# Altium schematic sheet shematic diagram.SchDoc (part 2 of 3)
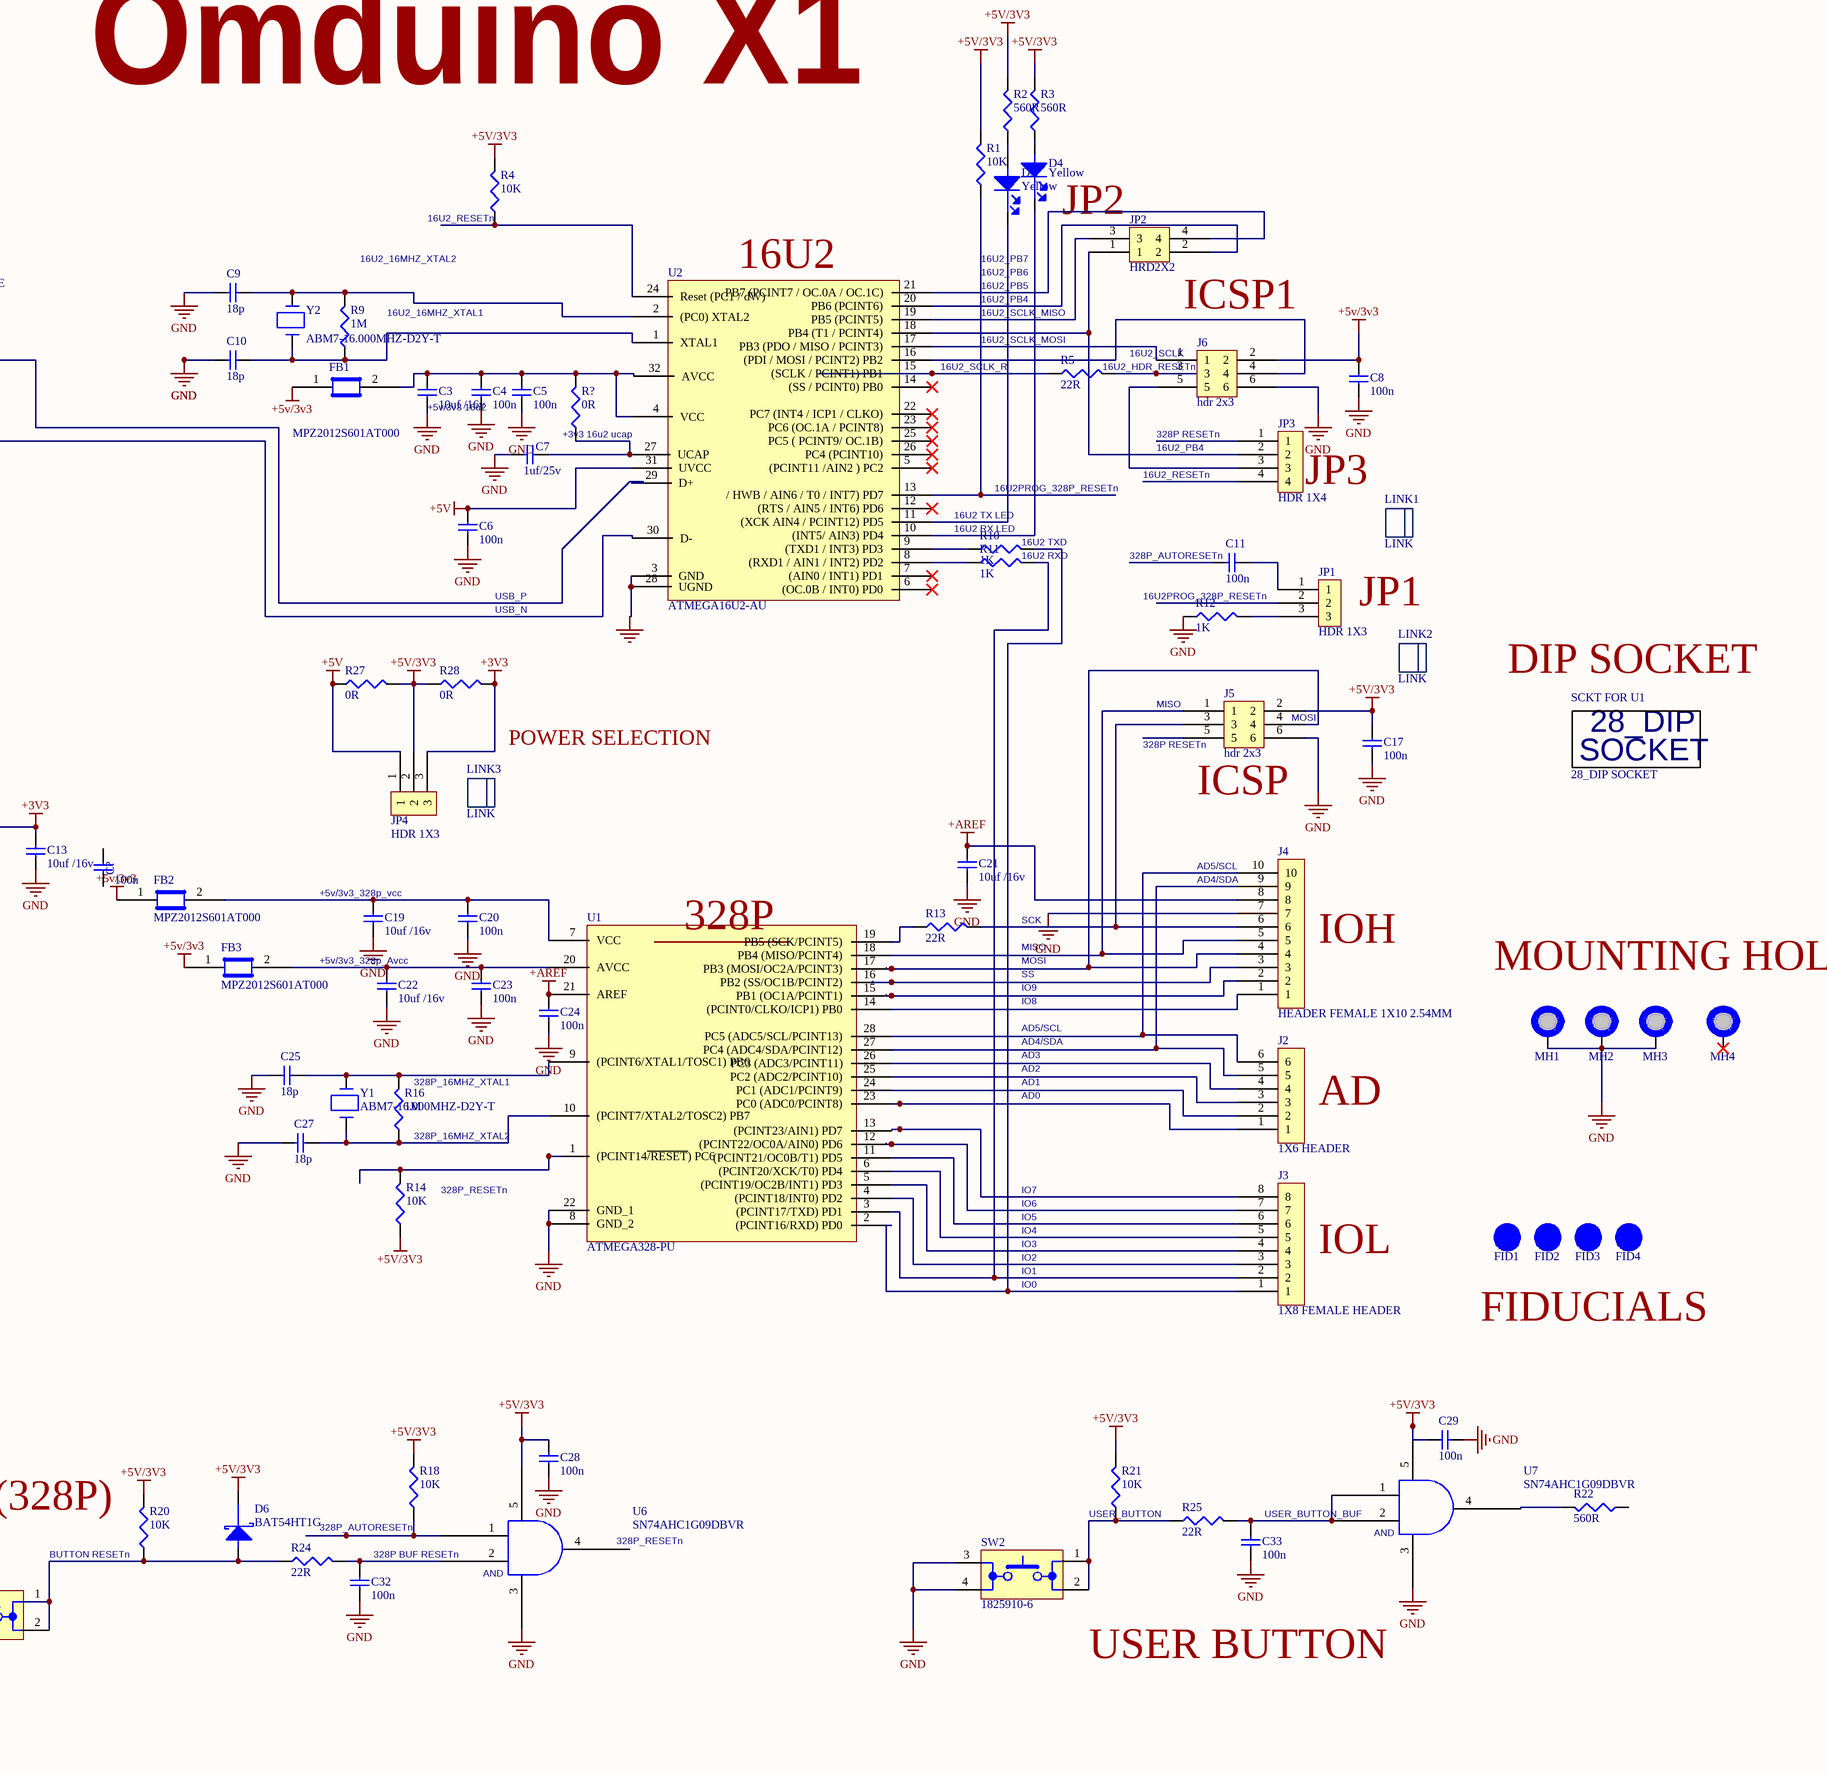
[diagram p4: shematic diagram.SchDoc, bottom right]
## Library data of the parts
C1 C2 = EEE-1AA101WR: Aluminum Electrolytic Capacitor, Polarized, Aluminum (wet), 10V, 20% +Tol, 20% -Tol, 100uF, Surface Mount, 2121; Manufacturer: Panasonic; Dielectric Material: Aluminium; Ripple Current: 50mA; Leakage Current: 10uA; Tan Delta: 0.3; Supplier: Digikey; Supplier Part Number: PCE3867CT-ND; Manufacturer Part Number: EEE-1AA101WR; RoHS: Yes; Category: Aluminum Electrolytic Capacitors; Stock: 77539; Pricing: 1=0.35, 10=0.228, 50=0.168, 100=0.1368, 500=0.108 (USD); Mounting Technology: Surface Mount; Pins: 2; Terminal Finish: Tin; Package Shape: Cylindrical; Case/Package: 2121; Min Operating Temperature: -40°C; Max Operating Temperature: 85°C; JESD-609 Code: e3,e6; Polarity: Polarized; Value: 100uF; Capacitor Type: Aluminium; Tolerance  (fill in as +-): 20%; Package Style: SMTMeter; Packaging: Tape and Reel; Tolerance (fill in as +-): 20%; Rated DC Voltage (URdc): 10V; Termination: Flat; Length: 6.5mm; Width: 5.3mm; Height: 5.4mm; RoHS Compliant: Yes; Reach SVHC Compliant: Yes; ComponentLink1URL: https://datasheet.ciiva.com:443/pdfs/VipMasterIC/IC/PANA/PANA-S-A0009615203/PANA-S-A0009615203-1.pdf?src-supplier=IHS+Markit; ComponentLink1Description: https://datasheet.ciiva.com:443/pdfs/VipMasterIC/IC/PANA/PANA-S-A0009615203/PANA-S-A0009615203-1.pdf?src-supplier=IHS+Markit; ComponentLink2URL: https://datasheet.ciiva.com/26945/getdatasheetpartid-169213-26945071.pdf?src-supplier=Verical; ComponentLink2Description: https://datasheet.ciiva.com/26945/getdatasheetpartid-169213-26945071.pdf?src-supplier=Verical; ComponentLink3URL: https://datasheet.ciiva.com/24027/aba0000ce2-40801-24027541.pdf?src-supplier=Mouser; ComponentLink3Description: https://datasheet.ciiva.com/24027/aba0000ce2-40801-24027541.pdf?src-supplier=Mouser; ComponentLink4URL: https://datasheet.ciiva.com/14598/70255710-14598233.pdf?src-supplier=Allied+Electronics; ComponentLink4Description: https://datasheet.ciiva.com/14598/70255710-14598233.pdf?src-supplier=Allied+Electronics; ComponentLink5URL: https://datasheet.ciiva.com/11673/aba0000ce2-11673882.pdf?src-supplier=Avnet; ComponentLink5Description: https://datasheet.ciiva.com/11673/aba0000ce2-11673882.pdf?src-supplier=Avnet; ComponentLink6URL: https://datasheet.ciiva.com/2983/aba0000ce2-2983906.pdf?src-supplier=Avnet; ComponentLink6Description: https://datasheet.ciiva.com/2983/aba0000ce2-2983906.pdf?src-supplier=Avnet; ComponentLink7URL: https://datasheet.ciiva.com/30075/11aba0000ce2-30075303.pdf?src-supplier=Onlinecomponents.com; ComponentLink7Description: https://datasheet.ciiva.com/30075/11aba0000ce2-30075303.pdf?src-supplier=Onlinecomponents.com; ComponentLink8URL: https://datasheet.ciiva.com/14605/70255710-14605689.pdf?src-supplier=Allied+Electronics; ComponentLink8Description: https://datasheet.ciiva.com/14605/70255710-14605689.pdf?src-supplier=Allied+Electronics; ComponentLink9URL: https://datasheet.ciiva.com/16427/aba0000ce2-16427544.pdf?src-supplier=Future+Electronics; ComponentLink9Description: https://datasheet.ciiva.com/16427/aba0000ce2-16427544.pdf?src-supplier=Future+Electronics
C3 C12 C13 C19 C21 C22 C34 = 10 uf /C2012X5R1C106M085AC: Ceramic Capacitor, Multilayer, Ceramic, 16V, 20% +Tol, 20% -Tol, X5R, 15% TC, 10uF, Surface Mount, 0805; Manufacturer: TDK; Multilayer: Yes; Supplier: Digikey; Supplier Part Number: 445-7645-1-ND; Manufacturer Part Number: C2012X5R1C106M085AC; RoHS: Yes; Category: Ceramic Capacitors; Stock: 610144; Pricing: 1=0.26, 10=0.169, 50=0.1066, 100=0.0853, 500=0.0616, 1000=0.05449 (USD); Mounting Technology: Surface Mount; Pins: 2; Dielectric Material: Ceramic; Package Shape: Rectangular; Case/Package: 0805; Terminal Finish: Nickel; Min Operating Temperature: -55°C; Max Operating Temperature: 85°C; JESD-609 Code: e3; Value: 10uF; Capacitor Type: Ceramic; Tolerance  (fill in as +-): 20%; Package Style: SMTMeter; Packaging: Tape and Reel; Tolerance (fill in as +-): 20%; Rated DC Voltage (URdc): 16V; Temperature Characteristics Code: X5R; Termination: Wraparound; Length: 2mm; Width: 1.25mm; Height: 0.85mm; Reach SVHC Compliant: Yes; RoHS Compliant: Yes; ComponentLink1URL: https://datasheet.ciiva.com:443/pdfs/VipMasterIC/IC/TDKC/TDKC-S-A0008796792/TDKC-S-A0008796792-1.pdf?src-supplier=IHS+Markit; ComponentLink1Description: https://datasheet.ciiva.com:443/pdfs/VipMasterIC/IC/TDKC/TDKC-S-A0008796792/TDKC-S-A0008796792-1.pdf?src-supplier=IHS+Markit; ComponentLink2URL: https://datasheet.ciiva.com/24218/c2012x5r1c106m085ac-265002-24218340.pdf?src-supplier=Mouser; ComponentLink2Description: https://datasheet.ciiva.com/24218/c2012x5r1c106m085ac-265002-24218340.pdf?src-supplier=Mouser; ComponentLink3URL: https://datasheet.ciiva.com/11788/0900766b80c1bb00-11788108.pdf?src-supplier=Rs; ComponentLink3Description: https://datasheet.ciiva.com/11788/0900766b80c1bb00-11788108.pdf?src-supplier=Rs; ComponentLink4URL: https://datasheet.ciiva.com/22725/1913358-22725557.pdf?src-supplier=Element14; ComponentLink4Description: https://datasheet.ciiva.com/22725/1913358-22725557.pdf?src-supplier=Element14; ComponentLink5URL: https://datasheet.ciiva.com/6290/tdkmlcccaprange-6290485.pdf?src-supplier=Digikey; ComponentLink5Description: https://datasheet.ciiva.com/6290/tdkmlcccaprange-6290485.pdf?src-supplier=Digikey; ComponentLink6URL: https://datasheet.ciiva.com/23803/1796654-23803021.pdf?src-supplier=Newark; ComponentLink6Description: https://datasheet.ciiva.com/23803/1796654-23803021.pdf?src-supplier=Newark; ComponentLink7URL: https://datasheet.ciiva.com/6290/tdkmlcccaprange-6290487.pdf?src-supplier=Digikey; ComponentLink7Description: https://datasheet.ciiva.com/6290/tdkmlcccaprange-6290487.pdf?src-supplier=Digikey; ComponentLink8URL: https://datasheet.ciiva.com/16449/e412-c-16449591.pdf?src-supplier=Future+Electronics; ComponentLink8Description: https://datasheet.ciiva.com/16449/e412-c-16449591.pdf?src-supplier=Future+Electronics
C4-C6 C8 C11 C14-C17 C20 C23 C24 C26 C28-C33 C? = C2012X7R1H104K085AA: Ceramic Capacitor, Multilayer, Ceramic, 50V, 10% +Tol, 10% -Tol, X7R, 15% TC, 0.1uF, Surface Mount, 0805; Manufacturer: TDK; Value: 100nF; Multilayer: Yes; Supplier: Digikey; Supplier Part Number: 445-7534-1-ND; Manufacturer Part Number: C2012X7R1H104K085AA; RoHS: Yes; Category: Ceramic Capacitors; Stock: 1483565; Pricing: 1=0.14, 10=0.092, 50=0.0552, 100=0.0434, 500=0.03204, 1000=0.02653 (USD); Mounting Technology: Surface Mount; Pins: 2; Dielectric Material: Ceramic; Package Shape: Rectangular; Case/Package: 0805; Terminal Finish: Nickel; Min Operating Temperature: -55°C; Max Operating Temperature: 125°C; JESD-609 Code: e3; Capacitor Type: Ceramic; Tolerance  (fill in as +-): 10%; Package Style: SMTMeter; Packaging: Tape and Reel; Tolerance (fill in as +-): 10%; Rated DC Voltage (URdc): 50V; Temperature Characteristics Code: X7R; Termination: Wraparound; Length: 2mm; Width: 1.25mm; Height: 0.85mm; Reach SVHC Compliant: Yes; RoHS Compliant: Yes; ComponentLink1URL: https://datasheet.ciiva.com:443/pdfs/VipMasterIC/IC/TDKC/TDKC-S-A0008796792/TDKC-S-A0008796792-1.pdf?src-supplier=IHS+Markit; ComponentLink1Description: https://datasheet.ciiva.com:443/pdfs/VipMasterIC/IC/TDKC/TDKC-S-A0008796792/TDKC-S-A0008796792-1.pdf?src-supplier=IHS+Markit; ComponentLink2URL: https://datasheet.ciiva.com/11788/0900766b80c1bb00-11788128.pdf?src-supplier=Rs; ComponentLink2Description: https://datasheet.ciiva.com/11788/0900766b80c1bb00-11788128.pdf?src-supplier=Rs; ComponentLink3URL: https://datasheet.ciiva.com/23803/1796654-23803035.pdf?src-supplier=Newark; ComponentLink3Description: https://datasheet.ciiva.com/23803/1796654-23803035.pdf?src-supplier=Newark; ComponentLink4URL: https://datasheet.ciiva.com/28602/1571323-28602204.pdf?src-supplier=Element14; ComponentLink4Description: https://datasheet.ciiva.com/28602/1571323-28602204.pdf?src-supplier=Element14; ComponentLink5URL: https://datasheet.ciiva.com/6250/tdkmlcccaprange-6250824.pdf?src-supplier=Digikey; ComponentLink5Description: https://datasheet.ciiva.com/6250/tdkmlcccaprange-6250824.pdf?src-supplier=Digikey; ComponentLink6URL: https://datasheet.ciiva.com/24191/e412-c-24191447.pdf?src-supplier=Future+Electronics; ComponentLink6Description: https://datasheet.ciiva.com/24191/e412-c-24191447.pdf?src-supplier=Future+Electronics; ComponentLink7URL: https://datasheet.ciiva.com/6250/tdkmlcccaprange-6250821.pdf?src-supplier=Digikey; ComponentLink7Description: https://datasheet.ciiva.com/6250/tdkmlcccaprange-6250821.pdf?src-supplier=Digikey
C7 = C2012X5R1E105K125AA: Ceramic Capacitor, Multilayer, Ceramic, 25V, 10% +Tol, 10% -Tol, X5R, 15% TC, 1uF, Surface Mount, 0805; Manufacturer: TDK; Multilayer: Yes; Supplier: Digikey; Supplier Part Number: 445-1419-1-ND; Manufacturer Part Number: C2012X5R1E105K125AA; RoHS: Yes; Category: Ceramic Capacitors; Stock: 73732; Pricing: 1=0.22, 10=0.141, 50=0.089, 100=0.0712, 500=0.05142, 1000=0.04548 (USD); Mounting Technology: Surface Mount; Pins: 2; Dielectric Material: Ceramic; Terminal Finish: Nickel; Package Shape: Rectangular; Case/Package: 0805; Min Operating Temperature: -55°C; Max Operating Temperature: 85°C; JESD-609 Code: e3; Capacitor Type: Ceramic; Value: 1uF; Tolerance  (fill in as +-): 10%; Package Style: SMTMeter; Packaging: Tape and Reel; Tolerance (fill in as +-): 10%; Rated DC Voltage (URdc): 25V; Temperature Characteristics Code: X5R; Termination: Wraparound; Length: 2mm; Width: 1.25mm; Height: 1.25mm; Reach SVHC Compliant: Yes; RoHS Compliant: Yes; ComponentLink1URL: https://datasheet.ciiva.com:443/pdfs/VipMasterIC/IC/TDKC/TDKC-S-A0008796792/TDKC-S-A0008796792-1.pdf?src-supplier=IHS+Markit; ComponentLink1Description: https://datasheet.ciiva.com:443/pdfs/VipMasterIC/IC/TDKC/TDKC-S-A0008796792/TDKC-S-A0008796792-1.pdf?src-supplier=IHS+Markit; ComponentLink2URL: https://datasheet.ciiva.com/11787/0900766b80c1bb00-11787608.pdf?src-supplier=Rs; ComponentLink2Description: https://datasheet.ciiva.com/11787/0900766b80c1bb00-11787608.pdf?src-supplier=Rs; ComponentLink3URL: https://datasheet.ciiva.com/28602/1744655-28602171.pdf?src-supplier=Element14; ComponentLink3Description: https://datasheet.ciiva.com/28602/1744655-28602171.pdf?src-supplier=Element14; ComponentLink4URL: https://datasheet.ciiva.com/16449/e412-c-16449595.pdf?src-supplier=Future+Electronics; ComponentLink4Description: https://datasheet.ciiva.com/16449/e412-c-16449595.pdf?src-supplier=Future+Electronics; ComponentLink5URL: https://datasheet.ciiva.com/15192/getdatasheetpartid-726707-15192140.pdf?src-supplier=Verical; ComponentLink5Description: https://datasheet.ciiva.com/15192/getdatasheetpartid-726707-15192140.pdf?src-supplier=Verical
C9 C10 C25 C27 = C0805C180J5GACTU: Ceramic Capacitor, Multilayer, Ceramic, 50V, 5% +Tol, 5% -Tol, C0G, -/+30ppm/Cel TC, 0.000018uF, Surface Mount, 0805; Manufacturer: KEMET; Value: 18pF; Multilayer: Yes; Supplier: Digikey; Supplier Part Number: 399-C0805C180J5GAC7800CT-ND; Manufacturer Part Number: C0805C180J5GACTU; RoHS: Yes; Category: Ceramic Capacitors; Stock: 74721; Pricing: 1=0.11, 10=0.075, 50=0.045, 100=0.0355, 500=0.02618, 1000=0.02168 (USD); Mounting Technology: Surface Mount; Pins: 2; Dielectric Material: Ceramic; Package Shape: Rectangular; Case/Package: 0805; Terminal Finish: Nickel; Min Operating Temperature: -55°C; Max Operating Temperature: 125°C; JESD-609 Code: e3; Termination: Wraparound; Capacitor Type: Ceramic; Tolerance  (fill in as +-): 5%; Packaging: Tape and Reel; Tolerance (fill in as +-): 5%; Rated DC Voltage (URdc): 50V; Temperature Characteristics Code: C0G; RoHS Compliant: Yes; Reach SVHC Compliant: Yes; ComponentLink1URL: https://datasheet.ciiva.com:443/pdfs/VipMasterIC/IC/KEME/KEME-S-A0000339979/KEME-S-A0000339979-1.pdf?src-supplier=IHS+Markit; ComponentLink1Description: https://datasheet.ciiva.com:443/pdfs/VipMasterIC/IC/KEME/KEME-S-A0000339979/KEME-S-A0000339979-1.pdf?src-supplier=IHS+Markit; ComponentLink2URL: https://datasheet.ciiva.com/22746/1769375-22746770.pdf?src-supplier=Element14; ComponentLink2Description: https://datasheet.ciiva.com/22746/1769375-22746770.pdf?src-supplier=Element14; ComponentLink3URL: https://datasheet.ciiva.com/26923/getdatasheetpartid-759702-26923980.pdf?src-supplier=Verical; ComponentLink3Description: https://datasheet.ciiva.com/26923/getdatasheetpartid-759702-26923980.pdf?src-supplier=Verical; ComponentLink4URL: https://datasheet.ciiva.com/26847/getdatasheetpartid-385668-26847862.pdf?src-supplier=Verical; ComponentLink4Description: https://datasheet.ciiva.com/26847/getdatasheetpartid-385668-26847862.pdf?src-supplier=Verical
D1 D2 = LOL29K-J2L1-24-Z: Single Color LED, Orange, Colorless Diffused, 1.3mm; Manufacturer: Osram Opto; Supplier: Digikey; Supplier Part Number: 475-LOL29K-J2L1-24-0-2-R18-ZCT-ND; Manufacturer Part Number: LOL29K-J2L1-24-Z; RoHS: Yes; Category: LEDs; Pricing: 1=0.41 (USD); ComponentLink1URL: https://datasheet.ciiva.com:443/pdfs/VipMasterIC/IC/OSOS/OSOS-S-A0008796331/OSOS-S-A0008796331-1.pdf?src-supplier=IHS+Markit; ComponentLink1Description: https://datasheet.ciiva.com:443/pdfs/VipMasterIC/IC/OSOS/OSOS-S-A0008796331/OSOS-S-A0008796331-1.pdf?src-supplier=IHS+Markit; ComponentLink2URL: https://datasheet.ciiva.com/26920/getdatasheetpartid-707592-26920833.pdf?src-supplier=Verical; ComponentLink2Description: https://datasheet.ciiva.com/26920/getdatasheetpartid-707592-26920833.pdf?src-supplier=Verical; ComponentLink3URL: https://datasheet.ciiva.com/2112/00077105-0-2112938.pdf?src-supplier=Digikey; ComponentLink3Description: https://datasheet.ciiva.com/2112/00077105-0-2112938.pdf?src-supplier=Digikey; ComponentLink4URL: https://datasheet.ciiva.com/2112/00077105-0-2112937.pdf?src-supplier=Digikey; ComponentLink4Description: https://datasheet.ciiva.com/2112/00077105-0-2112937.pdf?src-supplier=Digikey; ComponentLink5URL: https://datasheet.ciiva.com/2112/00077105-0-2112939.pdf?src-supplier=Digikey; ComponentLink5Description: https://datasheet.ciiva.com/2112/00077105-0-2112939.pdf?src-supplier=Digikey
D3 D4 D? = LYL29K-H1K2-26-Z: LED Uni-Color Yellow 591nm 2-Pin SMT T/R; Manufacturer: Osram Opto; Supplier: Digikey; Supplier Part Number: 475-LYL29K-H1K2-26-ZCT-ND; Manufacturer Part Number: LYL29K-H1K2-26-Z; RoHS: Yes; Category: LEDs; Stock: 93893; Pricing: 1=0.37, 10=0.293, 100=0.1315, 500=0.11878, 1000=0.09757, 2000=0.08484 (USD); ComponentLink1URL: https://datasheet.ciiva.com/26920/getdatasheetpartid-774632-26920797.pdf?src-supplier=Verical; ComponentLink1Description: https://datasheet.ciiva.com/26920/getdatasheetpartid-774632-26920797.pdf?src-supplier=Verical; ComponentLink2URL: https://datasheet.ciiva.com/2112/00077106-0-2112835.pdf?src-supplier=Digikey; ComponentLink2Description: https://datasheet.ciiva.com/2112/00077106-0-2112835.pdf?src-supplier=Digikey; ComponentLink3URL: https://datasheet.ciiva.com/2112/00077106-0-2112837.pdf?src-supplier=Digikey; ComponentLink3Description: https://datasheet.ciiva.com/2112/00077106-0-2112837.pdf?src-supplier=Digikey; ComponentLink4URL: https://datasheet.ciiva.com/2112/00077106-0-2112836.pdf?src-supplier=Digikey; ComponentLink4Description: https://datasheet.ciiva.com/2112/00077106-0-2112836.pdf?src-supplier=Digikey; ComponentLink5URL: https://datasheet.ciiva.com/4688/lyl29k-smartled0603-471955-4688317.pdf?src-supplier=Mouser; ComponentLink5Description: https://datasheet.ciiva.com/4688/lyl29k-smartled0603-471955-4688317.pdf?src-supplier=Mouser
D5 D6 = BAT54HT1G: Rectifier Diode, 1 Phase, 1 Element, 0.2A, 30V V(RRM), Silicon; Manufacturer: ON Semiconductor / Fairchild; Package Body Material: Plastic; Forward Voltage: 240mV; Non-rep Pk Forward Current-Max: 600mA; Number of Elements: 1; Max Output current: 200mA; Max Power Dissipation: 200mW; Reverse Recovery Time-Max: 0.005us; Qualification Status: Not Qualified; Supplier: Digikey; Supplier Part Number: BAT54HT1GOSCT-ND; Manufacturer Part Number: BAT54HT1G; RoHS: Yes; Category: Schottky Diodes; Stock: 171294; Pricing: 1=0.2, 10=0.138, 100=0.0675, 500=0.05634, 1000=0.03915 (USD); Pins: 2; Diode Element Material: SILICON; Package Shape: Rectangular; Terminal Finish: Tin; Min Operating Temperature: -55°C; Max Operating Temperature: 150°C; Diode Type: RECTIFIER; JESD-30 Code: R-PDSO-G2; Package Style: SMALL OUTLINEMeter; Rep Pk Reverse Voltage-Max: 30V; Surface Mount: Yes; Terminal Form: Gull Wing; Terminal Position: DUAL; JESD-609 Code: e3; Moisture Sensitivity Level: 1; RoHS Compliant: Yes; Reach SVHC Compliant: Yes; ComponentLink1URL: https://datasheet.ciiva.com:443/pdfs/VipMasterIC/IC/FAIR/FAIRS45107/FAIRS45107-1.pdf?src-supplier=IHS+Markit; ComponentLink1Description: https://datasheet.ciiva.com:443/pdfs/VipMasterIC/IC/FAIR/FAIRS45107/FAIRS45107-1.pdf?src-supplier=IHS+Markit; ComponentLink2URL: https://datasheet.ciiva.com/4714/bat54ht1-d-72881-4714706.pdf?src-supplier=Mouser; ComponentLink2Description: https://datasheet.ciiva.com/4714/bat54ht1-d-72881-4714706.pdf?src-supplier=Mouser; ComponentLink3URL: https://datasheet.ciiva.com/4452/bat54ht1g-104602-4452889.pdf?src-supplier=Mouser; ComponentLink3Description: https://datasheet.ciiva.com/4452/bat54ht1g-104602-4452889.pdf?src-supplier=Mouser; ComponentLink4URL: https://datasheet.ciiva.com/30479/0900766b811a63a9-30479442.pdf?src-supplier=Rs; ComponentLink4Description: https://datasheet.ciiva.com/30479/0900766b811a63a9-30479442.pdf?src-supplier=Rs; ComponentLink5URL: https://datasheet.ciiva.com/34301/806549-34301562.pdf?src-supplier=Jameco; ComponentLink5Description: https://datasheet.ciiva.com/34301/806549-34301562.pdf?src-supplier=Jameco; ComponentLink6URL: https://datasheet.ciiva.com/1240/1747983-1240762.pdf?src-supplier=Newark; ComponentLink6Description: https://datasheet.ciiva.com/1240/1747983-1240762.pdf?src-supplier=Newark; ComponentLink7URL: https://datasheet.ciiva.com/915/bat54ht1-d-915445.pdf?src-supplier=Digikey; ComponentLink7Description: https://datasheet.ciiva.com/915/bat54ht1-d-915445.pdf?src-supplier=Digikey; ComponentLink8URL: https://datasheet.ciiva.com/915/bat54ht1-d-915444.pdf?src-supplier=Digikey; ComponentLink8Description: https://datasheet.ciiva.com/915/bat54ht1-d-915444.pdf?src-supplier=Digikey; ComponentLink9URL: https://datasheet.ciiva.com/910/bat54ht1g-910499.pdf?src-supplier=Digikey; ComponentLink9Description: https://datasheet.ciiva.com/910/bat54ht1g-910499.pdf?src-supplier=Digikey; ComponentLink10URL: https://datasheet.ciiva.com/910/bat54ht1g-910498.pdf?src-supplier=Digikey; ComponentLink10Description: https://datasheet.ciiva.com/910/bat54ht1g-910498.pdf?src-supplier=Digikey; ComponentLink11URL: https://datasheet.ciiva.com/8294/bat54ht1-d-8294645.pdf?src-supplier=Avnet; ComponentLink11Description: https://datasheet.ciiva.com/8294/bat54ht1-d-8294645.pdf?src-supplier=Avnet; ComponentLink12URL: https://datasheet.ciiva.com/910/bat54ht1g-910497.pdf?src-supplier=Digikey; ComponentLink12Description: https://datasheet.ciiva.com/910/bat54ht1g-910497.pdf?src-supplier=Digikey; ComponentLink13URL: https://datasheet.ciiva.com/8303/bat54ht1g-8303645.pdf?src-supplier=Avnet; ComponentLink13Description: https://datasheet.ciiva.com/8303/bat54ht1g-8303645.pdf?src-supplier=Avnet; ComponentLink14URL: https://datasheet.ciiva.com/915/bat54ht1-d-915443.pdf?src-supplier=Digikey; ComponentLink14Description: https://datasheet.ciiva.com/915/bat54ht1-d-915443.pdf?src-supplier=Digikey; ComponentLink15URL: https://datasheet.ciiva.com/46429/1727620-46429206.pdf?src-supplier=Element14; ComponentLink15Description: https://datasheet.ciiva.com/46429/1727620-46429206.pdf?src-supplier=Element14; ComponentLink16URL: https://datasheet.ciiva.com/1180/bat54ht1-d-1180252.pdf?src-supplier=Element14; ComponentLink16Description: https://datasheet.ciiva.com/1180/bat54ht1-d-1180252.pdf?src-supplier=Element14; ComponentLink17URL: https://datasheet.ciiva.com/1180/bat54ht1-d-1180251.pdf?src-supplier=Element14; ComponentLink17Description: https://datasheet.ciiva.com/1180/bat54ht1-d-1180251.pdf?src-supplier=Element14; ComponentLink18URL: https://datasheet.ciiva.com/17020/bat54ht1g-17020445.pdf?src-supplier=Future+Electronics; ComponentLink18Description: https://datasheet.ciiva.com/17020/bat54ht1g-17020445.pdf?src-supplier=Future+Electronics; ComponentLink19URL: https://datasheet.ciiva.com/48686/001262925-da-01-en-diode-schottky-30v-bat54ht1g-sod-323-fsc-48686266.pdf?src-supplier=Conrad; ComponentLink19Description: https://datasheet.ciiva.com/48686/001262925-da-01-en-diode-schottky-30v-bat54ht1g-sod-323-fsc-48686266.pdf?src-supplier=Conrad
FB1-FB3 = MPZ2012S601AT000: Ferrite Chip, 1 Function(s), 2A; Manufacturer: TDK; DC Resistance-Max: 100mR; Clock Frequency: 100MHz; Channels: 1; Output Impedance: 600R; Supplier: Digikey; Supplier Part Number: 445-MPZ2012S601AT000CT-ND; Manufacturer Part Number: MPZ2012S601AT000; RoHS: Yes; Category: Ferrite Beads and Chips; Stock: 173654; Pricing: 1=0.12, 10=0.094, 25=0.0848, 50=0.0622, 100=0.0537, 250=0.0424, 500=0.03582, 1000=0.03016 (USD); Mounting Technology: Surface Mount; Material: Ferrite; Case Code: 0805; Terminal Finish: Copper; Min Operating Temperature: -55°C; Max Operating Temperature: 125°C; JESD-609 Code: e2; Construction: Chip Bead; Filter Type: FERRITE CHIP; Min Frequency: 100MHz; Packaging: Tape and Reel; Current Rating: 2A; Length: 2mm; Width: 1.25mm; Height: 0.85mm; Reach SVHC Compliant: Yes; RoHS Compliant: Yes; ComponentLink1URL: https://datasheet.ciiva.com:443/pdfs/VipMasterIC/IC/TDKC/TDKC-S-A0008032886/TDKC-S-A0008032886-1.pdf?src-supplier=IHS+Markit; ComponentLink1Description: https://datasheet.ciiva.com:443/pdfs/VipMasterIC/IC/TDKC/TDKC-S-A0008032886/TDKC-S-A0008032886-1.pdf?src-supplier=IHS+Markit; ComponentLink2URL: https://datasheet.ciiva.com/46634/beads-commercial-power-mpz-en-46634335.pdf?src-supplier=Digikey; ComponentLink2Description: https://datasheet.ciiva.com/46634/beads-commercial-power-mpz-en-46634335.pdf?src-supplier=Digikey; ComponentLink3URL: https://datasheet.ciiva.com/46634/beads-commercial-power-mpz-en-46634377.pdf?src-supplier=Digikey; ComponentLink3Description: https://datasheet.ciiva.com/46634/beads-commercial-power-mpz-en-46634377.pdf?src-supplier=Digikey; ComponentLink4URL: https://datasheet.ciiva.com/46634/beads-commercial-power-mpz-en-46634606.pdf?src-supplier=Digikey; ComponentLink4Description: https://datasheet.ciiva.com/46634/beads-commercial-power-mpz-en-46634606.pdf?src-supplier=Digikey
FID1-FID4 = FID_1MM: FIDUCIAL 40 MIL DIAMETER , 120 MIL MASK
J1 J3 = M20-7820842: Board Connector, 8 Contact(s), 1 Row(s), Female, Straight, 0.1 inch Pitch, Solder Terminal, Locking, Black Insulator, Socket; Manufacturer: Harwin; Option: General Purpose; Contact Pattern: RECTANGULAR; Contact Resistance: 20mR; Contact Style: SQ PIN-SKT; Dielectric Withstanding Voltage (AC): 1kV; Durability: 300Cycles; Filter Feature: No; Insulation Resistance: 1GR; Number Of Connectors: 1; Polarization Key: POLARIZED HOUSING; Rated Current (Signal): 3A; Number of Contacts: 8; Body Breadth: 0.098inch; Body Depth: 0.335inch; Body Length: 0.8inch; Reference Standard: UL; Reliability: COMMERCIAL; Supplier: Digikey; Supplier Part Number: 952-1823-ND; Manufacturer Part Number: M20-7820842; RoHS: Yes; Category: Headers and Wire Housings; Stock: 2451; Pricing: 1=1.44, 27=1.16556, 108=1.09102, 513=0.89263, 1026=0.79346, 5022=0.69427, 10017=0.65956 (USD); Mounting Technology: Board; Contact Finish - Mating: GOLD; Contact Finish - Termination: Tin (Sn) - with Nickel (Ni) barrier; Insulation Color: Black; Insulation Material: Polyamide; Min Operating Temperature: -40°C; Max Operating Temperature: 105°C; Connector Type: BOARD CONNECTOR; JESD-609 Code: e3; Body/Shell Style: SOCKET; Contact Gender: Female; Mixed Contacts: No; Mounting Style: STRAIGHT; Number Of PCB Rows: 1; Number of Rows Loaded: 1; PCB Contact Pattern: RECTANGULAR; Termination: Solder; Mating Contact Pitch: 0.1inch; Mounting Option 1: LOCKING; Terminal Length: 0.118inch; Terminal Pitch: 2.54mm; Flammability Rating: UL94 V-0; DIN Conformance: No; IEC Conformance: No; MIL Conformance: No; Reach SVHC Compliant: Yes; RoHS Compliant: Yes; ComponentLink1URL: https://datasheet.ciiva.com:443/pdfs/VipMasterIC/IC/HRWN/HRWN-S-A0004894635/HRWN-S-A0004894635-1.pdf?src-supplier=IHS+Markit; ComponentLink1Description: https://datasheet.ciiva.com:443/pdfs/VipMasterIC/IC/HRWN/HRWN-S-A0004894635/HRWN-S-A0004894635-1.pdf?src-supplier=IHS+Markit; ComponentLink2URL: https://datasheet.ciiva.com/9480/m20-782-9480074.pdf?src-supplier=Avnet; ComponentLink2Description: https://datasheet.ciiva.com/9480/m20-782-9480074.pdf?src-supplier=Avnet
J2 = M20-7820646: Board Connector, 6 Contact(s), 1 Row(s), Female, Straight, 0.1 inch Pitch, Solder Terminal, Locking, Black Insulator, Socket; Manufacturer: Harwin; Option: General Purpose; Contact Pattern: RECTANGULAR; Contact Resistance: 20mR; Contact Style: SQ PIN-SKT; Dielectric Withstanding Voltage (AC): 1kV; Durability: 300Cycles; Filter Feature: No; Insulation Resistance: 1GR; Number Of Connectors: 1; Polarization Key: POLARIZED HOUSING; Rated Current (Signal): 3A; Number of Contacts: 6; Body Breadth: 0.098inch; Body Depth: 0.335inch; Body Length: 0.6inch; Reference Standard: UL; Reliability: COMMERCIAL; Supplier: Digikey; Supplier Part Number: 952-1809-ND; Manufacturer Part Number: M20-7820646; RoHS: Yes; Category: Headers and Wire Housings; Stock: 878; Pricing: 1=1.24, 36=1.00861, 108=0.94435, 504=0.77266, 1008=0.6868, 5004=0.60095, 10008=0.5709 (USD); Mounting Technology: Board; Contact Finish - Mating: TIN; Contact Finish - Termination: Tin (Sn) - with Nickel (Ni) barrier; Insulation Color: Black; Insulation Material: Polyamide; Min Operating Temperature: -40°C; Max Operating Temperature: 105°C; Connector Type: BOARD CONNECTOR; JESD-609 Code: e3; Body/Shell Style: SOCKET; Contact Gender: Female; Mixed Contacts: No; Mounting Style: STRAIGHT; Number Of PCB Rows: 1; Number of Rows Loaded: 1; PCB Contact Pattern: RECTANGULAR; Termination: Solder; Mating Contact Pitch: 0.1inch; Mounting Option 1: LOCKING; Terminal Length: 0.118inch; Terminal Pitch: 2.54mm; Flammability Rating: UL94 V-0; DIN Conformance: No; IEC Conformance: No; MIL Conformance: No; Reach SVHC Compliant: Yes; RoHS Compliant: Yes; ComponentLink1URL: https://datasheet.ciiva.com:443/pdfs/VipMasterIC/IC/HRWN/HRWN-S-A0004894635/HRWN-S-A0004894635-1.pdf?src-supplier=IHS+Markit; ComponentLink1Description: https://datasheet.ciiva.com:443/pdfs/VipMasterIC/IC/HRWN/HRWN-S-A0004894635/HRWN-S-A0004894635-1.pdf?src-supplier=IHS+Markit; ComponentLink2URL: https://cdn.harwin.com/pdfs/Harwin_PC_Connectors_M20.pdf?src-supplier=Rs; ComponentLink2Description: https://cdn.harwin.com/pdfs/Harwin_PC_Connectors_M20.pdf?src-supplier=Rs; ComponentLink3URL: http://www.harwin.com/include/downloads/pdfs/2010PAGE120.PDF?src-supplier=Avnet; ComponentLink3Description: http://www.harwin.com/include/downloads/pdfs/2010PAGE120.PDF?src-supplier=Avnet; ComponentLink4URL: https://cdn.harwin.com/pdfs/M20-782.pdf?src-supplier=Digikey; ComponentLink4Description: https://cdn.harwin.com/pdfs/M20-782.pdf?src-supplier=Digikey; ComponentLink5URL: https://cdn.harwin.com/pdfs/Harwin_PC_Connectors_M20.pdf?src-supplier=Mouser; ComponentLink5Description: https://cdn.harwin.com/pdfs/Harwin_PC_Connectors_M20.pdf?src-supplier=Mouser; ComponentLink6URL: https://cdn.harwin.com/pdfs/Harwin_PC_Connectors_M20.pdf?src-supplier=TTI; ComponentLink6Description: https://cdn.harwin.com/pdfs/Harwin_PC_Connectors_M20.pdf?src-supplier=TTI
J4 = M20-7821046: Board Connector, 10 Contact(s), 1 Row(s), Female, Straight, 0.1 inch Pitch, Solder Terminal, Locking, Black Insulator, Socket; Manufacturer: Harwin; Option: General Purpose; Contact Pattern: RECTANGULAR; Contact Resistance: 20mR; Contact Style: SQ PIN-SKT; Dielectric Withstanding Voltage (AC): 1kV; Durability: 300Cycles; Filter Feature: No; Insertion Force-Max: 4.8928N; Insulation Resistance: 1GR; Number Of Connectors: 1; Polarization Key: POLARIZED HOUSING; Rated Current (Signal): 3A; Number of Contacts: 10; Body Breadth: 0.098inch; Body Depth: 0.335inch; Body Length: 1inch; Reference Standard: UL; Reliability: COMMERCIAL; Supplier: Digikey; Supplier Part Number: 952-1847-ND; Manufacturer Part Number: M20-7821046; RoHS: Yes; Category: Headers and Wire Housings; Stock: 2123; Pricing: 1=1.46, 22=1.27, 110=1.13473, 506=0.94561, 1012=0.81052, 5016=0.71867, 10010=0.70245 (USD); Mounting Technology: Board; Contact Finish - Mating: TIN; Contact Finish - Termination: Tin (Sn) - with Nickel (Ni) barrier; Insulation Color: Black; Insulation Material: Nylon; Min Operating Temperature: -40°C; Max Operating Temperature: 105°C; Connector Type: BOARD CONNECTOR; JESD-609 Code: e3; Body/Shell Style: SOCKET; Contact Gender: Female; Mixed Contacts: No; Mounting Style: STRAIGHT; Number Of PCB Rows: 1; Number of Rows Loaded: 1; PCB Contact Pattern: RECTANGULAR; Termination: Solder; Mating Contact Pitch: 0.1inch; Mounting Option 1: LOCKING; Terminal Length: 0.118inch; Terminal Pitch: 2.54mm; Flammability Rating: UL94 V-0; Reach SVHC Compliant: Yes; RoHS Compliant: Yes; DIN Conformance: No; IEC Conformance: No; MIL Conformance: No; ComponentLink1URL: https://datasheet.ciiva.com:443/pdfs/VipMasterIC/IC/HRWN/HRWN-S-A0004894635/HRWN-S-A0004894635-1.pdf?src-supplier=IHS+Markit; ComponentLink1Description: https://datasheet.ciiva.com:443/pdfs/VipMasterIC/IC/HRWN/HRWN-S-A0004894635/HRWN-S-A0004894635-1.pdf?src-supplier=IHS+Markit; ComponentLink2URL: https://datasheet.ciiva.com/11753/0900766b80dc1d2b-11753869.pdf?src-supplier=Rs; ComponentLink2Description: https://datasheet.ciiva.com/11753/0900766b80dc1d2b-11753869.pdf?src-supplier=Rs; ComponentLink3URL: https://datasheet.ciiva.com/26899/getdatasheetpartid-559226-26899379.pdf?src-supplier=Verical; ComponentLink3Description: https://datasheet.ciiva.com/26899/getdatasheetpartid-559226-26899379.pdf?src-supplier=Verical; ComponentLink4URL: https://datasheet.ciiva.com/6785/m20-782-6785605.pdf?src-supplier=Digikey; ComponentLink4Description: https://datasheet.ciiva.com/6785/m20-782-6785605.pdf?src-supplier=Digikey; ComponentLink5URL: https://datasheet.ciiva.com/10151/m20-782-10151366.pdf?src-supplier=Avnet; ComponentLink5Description: https://datasheet.ciiva.com/10151/m20-782-10151366.pdf?src-supplier=Avnet
J5 J6 = 67997-106HLF: Conn Unshrouded Header HDR 6 POS 2.54mm Solder ST Top Entry Thru-Hole BergStik® Bulk; Manufacturer: Amphenol ICC / FCI; Supplier: Digikey; Supplier Part Number: 609-3393-ND; Manufacturer Part Number: 67997-106HLF; RoHS: No; Category: Headers and Wire Housings; Stock: 1064; Pricing: 1=0.63, 10=0.547, 100=0.4511, 500=0.39228, 1000=0.32363, 5000=0.28441, 10000=0.26479 (USD); ComponentLink1URL: http://uk.rs-online.com/webdocs/1450/0900766b81450b8b.pdf?src-supplier=Rs; ComponentLink1Description: http://uk.rs-online.com/webdocs/1450/0900766b81450b8b.pdf?src-supplier=Rs; ComponentLink2URL: http://www.farnell.com/datasheets/1876884.pdf?src-supplier=Newark; ComponentLink2Description: http://www.farnell.com/datasheets/1876884.pdf?src-supplier=Newark; ComponentLink3URL: https://cdn.amphenol-icc.com/media/wysiwyg/files/drawing/67996.pdf?src-supplier=Onlinecomponents.com; ComponentLink3Description: https://cdn.amphenol-icc.com/media/wysiwyg/files/drawing/67996.pdf?src-supplier=Onlinecomponents.com; ComponentLink4URL: https://cdn.amphenol-icc.com/media/wysiwyg/files/drawing/67996.pdf?src-supplier=Allied+Electronics; ComponentLink4Description: https://cdn.amphenol-icc.com/media/wysiwyg/files/drawing/67996.pdf?src-supplier=Allied+Electronics; ComponentLink5URL: https://datasheet.octopart.com/67997-106HLF-Areva-datasheet-118652.pdf?src-supplier=Digikey; ComponentLink5Description: https://datasheet.octopart.com/67997-106HLF-Areva-datasheet-118652.pdf?src-supplier=Digikey; ComponentLink6URL: http://components.arrow.com/part/dataview/41913658S7633350N8314?src-supplier=Arrow+Electronics; ComponentLink6Description: http://components.arrow.com/part/dataview/41913658S7633350N8314?src-supplier=Arrow+Electronics; ComponentLink7URL: https://datasheet.octopart.com/67997-106HLF-Amphenol-Communications-Solutions-datasheet-36854132.pdf?src-supplier=Farnell; ComponentLink7Description: https://datasheet.octopart.com/67997-106HLF-Amphenol-Communications-Solutions-datasheet-36854132.pdf?src-supplier=Farnell; ComponentLink8URL: https://cdn.amphenol-icc.com/media/wysiwyg/files/drawing/67996.pdf?src-supplier=Avnet; ComponentLink8Description: https://cdn.amphenol-icc.com/media/wysiwyg/files/drawing/67996.pdf?src-supplier=Avnet; ComponentLink9URL: https://cdn.amphenol-icc.com/media/wysiwyg/files/drawing/67996.pdf?src-supplier=Mouser; ComponentLink9Description: https://cdn.amphenol-icc.com/media/wysiwyg/files/drawing/67996.pdf?src-supplier=Mouser; ComponentLink10URL: https://cdn.amphenol-icc.com/media/wysiwyg/files/drawing/67996.pdf?src-supplier=Heilind+Electronics; ComponentLink10Description: https://cdn.amphenol-icc.com/media/wysiwyg/files/drawing/67996.pdf?src-supplier=Heilind+Electronics; ComponentLink11URL: https://cdn.amphenol-icc.com/media/wysiwyg/files/drawing/67996.pdf?src-supplier=TTI; ComponentLink11Description: https://cdn.amphenol-icc.com/media/wysiwyg/files/drawing/67996.pdf?src-supplier=TTI
J7 = 10118193-0001LF: USB Connector, 5 Contact(s), Female, Right Angle, Surface Mount Terminal, Locking, Receptacle; Manufacturer: Amphenol Communications Solutions; Supplier: Digikey; Supplier Part Number: 609-4616-1-ND; Manufacturer Part Number: 10118193-0001LF; RoHS: No; Category: USB Connectors; Stock: 201468; Pricing: 1=0.46, 10=0.404, 25=0.3696, 50=0.3478, 100=0.3334, 250=0.30436, 500=0.28988 (USD); ComponentLink1URL: https://datasheet.octopart.com/10118193-0001LF-Amphenol-Communications-Solutions-datasheet-96019471.pdf?src-supplier=Element14; ComponentLink1Description: https://datasheet.octopart.com/10118193-0001LF-Amphenol-Communications-Solutions-datasheet-96019471.pdf?src-supplier=Element14; ComponentLink2URL: https://datasheet.octopart.com/10118193-0001LF-Amphenol-Communications-Solutions-datasheet-55953155.pdf?src-supplier=TME; ComponentLink2Description: https://datasheet.octopart.com/10118193-0001LF-Amphenol-Communications-Solutions-datasheet-55953155.pdf?src-supplier=TME; ComponentLink3URL: https://datasheet.octopart.com/10118193-0001LF-Amphenol-Communications-Solutions-datasheet-11792339.pdf?src-supplier=Electro+Sonic; ComponentLink3Description: https://datasheet.octopart.com/10118193-0001LF-Amphenol-Communications-Solutions-datasheet-11792339.pdf?src-supplier=Electro+Sonic
J8 J9 = PAD_WITH_HOLE_4MMX1.5MM: PAD WITH A HOLE
JP1 JP4 = 68000-103HLF: Conn Unshrouded Header HDR 3 POS 2.54mm Solder ST Top Entry Thru-Hole BergStik® Automotive Bulk; Manufacturer: Amphenol ICC / FCI; Supplier: Digikey; Supplier Part Number: 609-3461-ND; Manufacturer Part Number: 68000-103HLF; RoHS: No; Category: Headers and Wire Housings; Stock: 34479; Pricing: 1=0.37, 10=0.317, 100=0.2462, 500=0.21104, 1000=0.17587, 5000=0.15074, 10000=0.14069 (USD); ComponentLink1URL: https://datasheet.ciiva.com/46392/1914865-46392021.pdf?src-supplier=Element14; ComponentLink1Description: https://datasheet.ciiva.com/46392/1914865-46392021.pdf?src-supplier=Element14
JP2 = 68602-204HLF: Manufacturer: AMPHENOL ICC (FCI); Supplier: Digikey; Supplier Part Number: 609-3369-ND; Manufacturer Part Number: 68602-204HLF; RoHS: No
JP3 = 68001-204HLF: Conn Unshrouded Header HDR 4 POS 2.54mm Solder ST Thru-Hole Bag; Manufacturer: Amphenol ICC / FCI; Supplier: Digikey; Supplier Part Number: 609-3402-ND; Manufacturer Part Number: 68001-204HLF; RoHS: No; Category: Headers and Wire Housings; Stock: 14181; Pricing: 1=0.48, 10=0.407, 100=0.3162, 500=0.27106, 1000=0.22589, 5000=0.19362, 10000=0.18071 (USD); ComponentLink1URL: http://uk.rs-online.com/webdocs/1450/0900766b81450c68.pdf?src-supplier=Rs; ComponentLink1Description: http://uk.rs-online.com/webdocs/1450/0900766b81450c68.pdf?src-supplier=Rs; ComponentLink2URL: https://datasheet.octopart.com/68001-204HLF-Amphenol-Communications-Solutions-datasheet-41232361.pdf?src-supplier=Element14; ComponentLink2Description: https://datasheet.octopart.com/68001-204HLF-Amphenol-Communications-Solutions-datasheet-41232361.pdf?src-supplier=Element14; ComponentLink3URL: https://cdn.amphenol-icc.com/media/wysiwyg/files/drawing/68000.pdf?src-supplier=Allied+Electronics; ComponentLink3Description: https://cdn.amphenol-icc.com/media/wysiwyg/files/drawing/68000.pdf?src-supplier=Allied+Electronics; ComponentLink4URL: https://cdn.amphenol-icc.com/media/wysiwyg/files/drawing/68000.pdf?src-supplier=Digikey; ComponentLink4Description: https://cdn.amphenol-icc.com/media/wysiwyg/files/drawing/68000.pdf?src-supplier=Digikey; ComponentLink5URL: http://components.arrow.com/part/dataview/42735081S8853857N8314?src-supplier=Arrow+Electronics; ComponentLink5Description: http://components.arrow.com/part/dataview/42735081S8853857N8314?src-supplier=Arrow+Electronics; ComponentLink6URL: https://cdn.amphenol-icc.com/media/wysiwyg/files/drawing/68000.pdf?src-supplier=Avnet; ComponentLink6Description: https://cdn.amphenol-icc.com/media/wysiwyg/files/drawing/68000.pdf?src-supplier=Avnet; ComponentLink7URL: https://cdn.amphenol-icc.com/media/wysiwyg/files/drawing/68000.pdf?src-supplier=Mouser; ComponentLink7Description: https://cdn.amphenol-icc.com/media/wysiwyg/files/drawing/68000.pdf?src-supplier=Mouser; ComponentLink8URL: https://datasheet.octopart.com/68001-204HLF-Amphenol-Communications-Solutions-datasheet-100449246.pdf?src-supplier=Future+Electronics; ComponentLink8Description: https://datasheet.octopart.com/68001-204HLF-Amphenol-Communications-Solutions-datasheet-100449246.pdf?src-supplier=Future+Electronics; ComponentLink9URL: https://datasheet.octopart.com/68001-204HLF-Amphenol-Communications-Solutions-datasheet-154727322.pdf?src-supplier=Master+Electronics; ComponentLink9Description: https://datasheet.octopart.com/68001-204HLF-Amphenol-Communications-Solutions-datasheet-154727322.pdf?src-supplier=Master+Electronics; ComponentLink10URL: https://cdn.amphenol-icc.com/media/wysiwyg/files/drawing/68000.pdf?src-supplier=Heilind+Electronics; ComponentLink10Description: https://cdn.amphenol-icc.com/media/wysiwyg/files/drawing/68000.pdf?src-supplier=Heilind+Electronics; ComponentLink11URL: https://cdn.amphenol-icc.com/media/wysiwyg/files/drawing/68000.pdf?src-supplier=TTI; ComponentLink11Description: https://cdn.amphenol-icc.com/media/wysiwyg/files/drawing/68000.pdf?src-supplier=TTI
L1 = CIGT252008LM2R2MNE: General Purpose Inductor, 2.2uH, 20%, 1 Element, Metal Composite-Core, SMD; Manufacturer: Samsung; Core Material: Metal,Composite; DC Resistance (DCR): 97mR; Inductor Application: POWER INDUCTOR; Channels: 1; Max Current Rating: 2A; Shape/Size Description: RECTANGULAR PACKAGE; Shielding: Unshielded; Test Frequency: 1MHz; Supplier: Digikey; Supplier Part Number: 1276-6925-1-ND; Manufacturer Part Number: CIGT252008LM2R2MNE; RoHS: Yes; Category: Fixed Inductors; Stock: 204708; Pricing: 1=0.16, 10=0.129, 25=0.1192, 50=0.1094, 100=0.0964, 250=0.09344, 500=0.0835, 1000=0.07 (USD); Pins: 2; Min Operating Temperature: -40°C; Max Operating Temperature: 125°C; Tolerance: 20%; Inductance-Nom (L): 2.2uH; Inductor Type: GENERAL PURPOSE INDUCTOR; Surface Mount: Yes; Terminal Placement: Dual Ended; Termination: Wraparound; Reach SVHC Compliant: Yes; RoHS Compliant: Yes; ComponentLink1URL: https://datasheet.ciiva.com:443/pdfs/VipMasterIC/IC/SEMS/SEMS-S-A0002828022/SEMS-S-A0002828022-1.pdf?src-supplier=IHS+Markit; ComponentLink1Description: https://datasheet.ciiva.com:443/pdfs/VipMasterIC/IC/SEMS/SEMS-S-A0002828022/SEMS-S-A0002828022-1.pdf?src-supplier=IHS+Markit; ComponentLink2URL: http://www.samsungsem.com/kr/support/product-search/inductor/CIGT252008LM2R2MNE.jsp?src-supplier=Digikey; ComponentLink2Description: http://www.samsungsem.com/kr/support/product-search/inductor/CIGT252008LM2R2MNE.jsp?src-supplier=Digikey
LINK1-LINK3 = QPC02SXGN-RC: Shunts/Jumper Connector; Manufacturer: Sullins; Manufacturer Series: QPC; Contact Pattern: RECTANGULAR; Contact Style: SQ PIN-SKT; Number Of Connectors: 1; Polarization Key: POLARIZED HOUSING; Rated Current (Signal): 3A; Body Breadth: 0.097inch; Body Depth: 0.235inch; Body Length: 0.197inch; Mating Contact Pitch: 0.1inch; Mounting Option 1: LOCKING; Reference Standard: UL; Reliability: COMMERCIAL; Supplier: Digikey; Supplier Part Number: S9337-ND; Manufacturer Part Number: QPC02SXGN-RC; RoHS: Yes; Category: Connectors; Stock: 648797; Pricing: 1=0.1, 10=0.05, 25=0.0416, 50=0.0382, 100=0.0369, 250=0.03184, 500=0.03058, 2000=0.02548, 4000=0.02421 (USD); Contact Material: Brass; Contact Finish - Mating: AU; Insulation Material: Polybutylene; Connector Type: SHUNTS / JUMPER CONNECTOR; Contact Gender: Female; Mounting Style: STRAIGHT; Number of Rows Loaded: 1; Number of Contacts: 1; Reach SVHC Compliant: Yes; RoHS Compliant: Yes; ComponentLink1URL: https://datasheet.ciiva.com:443/pdfs/VipMasterIC/IC/SUCS/SUCS-S-Z0000000006/SUCS-S-Z0000000006-1.pdf?src-supplier=IHS+Markit; ComponentLink1Description: https://datasheet.ciiva.com:443/pdfs/VipMasterIC/IC/SUCS/SUCS-S-Z0000000006/SUCS-S-Z0000000006-1.pdf?src-supplier=IHS+Markit; ComponentLink2URL: https://datasheet.ciiva.com/767/284-sxgn-11510-767869.pdf?src-supplier=Digikey; ComponentLink2Description: https://datasheet.ciiva.com/767/284-sxgn-11510-767869.pdf?src-supplier=Digikey
MH1-MH3 = MOUNTING_HOLE_7.4MMC_3.2MMC
MH4 = MH_7.4MMNC_3.2_MMD
R1 R4 R14 R18-R21 = RC0805FR-0710KL: Fixed Resistor, Metal Glaze/thick Film, 0.125W, 10000ohm, 150V, 1% +/-Tol, 100ppm/Cel, Surface Mount, 0805; Manufacturer: Yageo; Additional Feature: LASER TRIMMABLE; Power: 125mW; Rated Temperature: 70°C; Value: 10kR; Temperature Coefficient: 100ppm/°C; Package Height: 0.5mm; Package Length: 2mm; Package Width: 1.25mm; Supplier: Digikey; Supplier Part Number: 311-10.0KCRCT-ND; Manufacturer Part Number: RC0805FR-0710KL; RoHS: Yes; Category: Chip SMD Resistors; Stock: 2611188; Pricing: 1=0.1, 10=0.027, 50=0.017, 100=0.0142, 500=0.00976, 1000=0.00844 (USD); Mounting Technology: Surface Mount; Pins: 2; Package Shape: Rectangular; Case/Package: 0805; Terminal Finish: Nickel; Min Operating Temperature: -55°C; Max Operating Temperature: 155°C; Tolerance: 1%; JESD-609 Code: e3; Termination: Wraparound; Resistor Type: FIXED RESISTOR; Construction: Chip; Package Style: SMTMeter; Packaging: Tape and Reel; Technology: METAL GLAZE/THICK FILM; Working Voltage: 150V; Reach SVHC Compliant: Yes; RoHS Compliant: Yes; ComponentLink1URL: https://datasheet.ciiva.com:443/pdfs/VipMasterIC/IC/YAGO/YAGO-S-A0008145938/YAGO-S-A0008145938-1.pdf?src-supplier=IHS+Markit; ComponentLink1Description: https://datasheet.ciiva.com:443/pdfs/VipMasterIC/IC/YAGO/YAGO-S-A0008145938/YAGO-S-A0008145938-1.pdf?src-supplier=IHS+Markit
R2 R3 R15 R17 R22 R?#1 R?#2 = RC0805FR-07560RL: Fixed Resistor, Metal Glaze/thick Film, 0.125W, 560ohm, 150V, 1% +/-Tol, 100ppm/Cel, Surface Mount, 0805; Manufacturer: Yageo; Additional Feature: LASER TRIMMABLE; Power: 125mW; Rated Temperature: 70°C; Temperature Coefficient: 100ppm/°C; Package Height: 0.5mm; Package Length: 2mm; Package Width: 1.25mm; Supplier: Digikey; Supplier Part Number: 311-560CRCT-ND; Manufacturer Part Number: RC0805FR-07560RL; RoHS: Yes; Category: Chip SMD Resistors; Stock: 97177; Pricing: 1=0.1, 10=0.025, 50=0.016, 100=0.0133, 500=0.00912, 1000=0.00787 (USD); Mounting Technology: Surface Mount; Pins: 2; Package Shape: Rectangular; Case/Package: 0805; Terminal Finish: Nickel; Min Operating Temperature: -55°C; Max Operating Temperature: 155°C; Tolerance: 1%; JESD-609 Code: e3; Resistor Type: FIXED RESISTOR; Construction: Chip; Package Style: SMTMeter; Packaging: Tape and Reel; Value: 560R; Technology: METAL GLAZE/THICK FILM; Termination: Wraparound; Working Voltage: 150V; Reach SVHC Compliant: Yes; RoHS Compliant: Yes; ComponentLink1URL: https://datasheet.ciiva.com:443/pdfs/VipMasterIC/IC/YAGO/YAGO-S-A0008145938/YAGO-S-A0008145938-1.pdf?src-supplier=IHS+Markit; ComponentLink1Description: https://datasheet.ciiva.com:443/pdfs/VipMasterIC/IC/YAGO/YAGO-S-A0008145938/YAGO-S-A0008145938-1.pdf?src-supplier=IHS+Markit
R5-R7 R13 R23-R25 = RC0805FR-0722RL: Fixed Resistor, Metal Glaze/thick Film, 0.125W, 22ohm, 150V, 1% +/-Tol, 100ppm/Cel, Surface Mount, 0805; Manufacturer: Yageo; Additional Feature: LASER TRIMMABLE; Power: 125mW; Rated Temperature: 70°C; Temperature Coefficient: 100ppm/°C; Package Height: 0.5mm; Package Length: 2mm; Package Width: 1.25mm; Supplier: Digikey; Supplier Part Number: 311-22.0CRCT-ND; Manufacturer Part Number: RC0805FR-0722RL; RoHS: Yes; Category: Chip SMD Resistors; Stock: 354360; Pricing: 1=0.1, 10=0.025, 50=0.016, 100=0.0133, 500=0.00912, 1000=0.00787 (USD); Mounting Technology: Surface Mount; Pins: 2; Package Shape: Rectangular; Case/Package: 0805; Terminal Finish: Nickel; Min Operating Temperature: -55°C; Max Operating Temperature: 155°C; Tolerance: 1%; JESD-609 Code: e3; Resistor Type: FIXED RESISTOR; Construction: Chip; Package Style: SMTMeter; Packaging: Tape and Reel; Value: 22R; Technology: METAL GLAZE/THICK FILM; Termination: Wraparound; Working Voltage: 150V; Reach SVHC Compliant: Yes; RoHS Compliant: Yes; ComponentLink1URL: https://datasheet.ciiva.com:443/pdfs/VipMasterIC/IC/YAGO/YAGO-S-A0008145938/YAGO-S-A0008145938-1.pdf?src-supplier=IHS+Markit; ComponentLink1Description: https://datasheet.ciiva.com:443/pdfs/VipMasterIC/IC/YAGO/YAGO-S-A0008145938/YAGO-S-A0008145938-1.pdf?src-supplier=IHS+Markit; ComponentLink2URL: https://datasheet.ciiva.com/11819/0900766b8106beab-11819837.pdf?src-supplier=Rs; ComponentLink2Description: https://datasheet.ciiva.com/11819/0900766b8106beab-11819837.pdf?src-supplier=Rs; ComponentLink3URL: https://datasheet.ciiva.com/2457/pyu-r-int-thick-7-2457044.pdf?src-supplier=Digikey; ComponentLink3Description: https://datasheet.ciiva.com/2457/pyu-r-int-thick-7-2457044.pdf?src-supplier=Digikey; ComponentLink4URL: https://datasheet.ciiva.com/2457/pyu-r-int-thick-7-2457045.pdf?src-supplier=Digikey; ComponentLink4Description: https://datasheet.ciiva.com/2457/pyu-r-int-thick-7-2457045.pdf?src-supplier=Digikey; ComponentLink5URL: https://datasheet.ciiva.com/2457/pyu-r-int-thick-7-2457046.pdf?src-supplier=Digikey; ComponentLink5Description: https://datasheet.ciiva.com/2457/pyu-r-int-thick-7-2457046.pdf?src-supplier=Digikey; ComponentLink6URL: https://datasheet.ciiva.com/12667/rc0805-12667371.pdf?src-supplier=Mouser; ComponentLink6Description: https://datasheet.ciiva.com/12667/rc0805-12667371.pdf?src-supplier=Mouser; ComponentLink7URL: https://datasheet.ciiva.com/46447/444164-46447574.pdf?src-supplier=Element14; ComponentLink7Description: https://datasheet.ciiva.com/46447/444164-46447574.pdf?src-supplier=Element14
R8 R27 R28 R?#3 = RC0805JR-070RL: Metal Glaze/thick Film, 0.125W, 0ohm, Surface Mount, 0805; Manufacturer: Yageo; Power: 125mW; Rated Temperature: 70°C; Package Height: 0.5mm; Package Length: 2mm; Package Width: 1.25mm; Supplier: Digikey; Supplier Part Number: 311-0.0ARCT-ND; Manufacturer Part Number: RC0805JR-070RL; RoHS: Yes; Category: Chip SMD Resistors; Stock: 938094; Pricing: 1=0.1, 10=0.027, 25=0.0204, 50=0.0156, 100=0.0109, 250=0.00876, 500=0.00702, 1000=0.00517 (USD); Mounting Technology: Surface Mount; Pins: 2; Package Shape: Rectangular; Case/Package: 0805; Terminal Finish: Nickel; Min Operating Temperature: -55°C; Max Operating Temperature: 155°C; JESD-609 Code: e3; Resistor Type: FIXED RESISTOR; Packaging: Tape and Reel; Value: 0R; Technology: METAL GLAZE/THICK FILM; Termination: Wraparound; Construction: Chip; Package Style: SMTMeter; Reach SVHC Compliant: Yes; RoHS Compliant: Yes; ComponentLink1URL: https://datasheet.ciiva.com:443/pdfs/VipMasterIC/IC/YAGO/YAGO-S-A0008145938/YAGO-S-A0008145938-1.pdf?src-supplier=IHS+Markit; ComponentLink1Description: https://datasheet.ciiva.com:443/pdfs/VipMasterIC/IC/YAGO/YAGO-S-A0008145938/YAGO-S-A0008145938-1.pdf?src-supplier=IHS+Markit
R9 R16 = RC0805FR-071ML: Fixed Resistor, Metal Glaze/thick Film, 0.125W, 1000000ohm, 150V, 1% +/-Tol, 100ppm/Cel, Surface Mount, 0805; Manufacturer: Yageo; Additional Feature: LASER TRIMMABLE; Power: 125mW; Rated Temperature: 70°C; Value: 1MR; Temperature Coefficient: 100ppm/°C; Package Height: 0.5mm; Package Length: 2mm; Package Width: 1.25mm; Supplier: Digikey; Supplier Part Number: 311-1.00MCRCT-ND; Manufacturer Part Number: RC0805FR-071ML; RoHS: Yes; Category: Chip SMD Resistors; Stock: 263580; Pricing: 1=0.1, 10=0.025, 50=0.016, 100=0.0133, 500=0.00912, 1000=0.00787 (USD); Mounting Technology: Surface Mount; Pins: 2; Package Shape: Rectangular; Case/Package: 0805; Terminal Finish: Nickel; Min Operating Temperature: -55°C; Max Operating Temperature: 155°C; Tolerance: 1%; JESD-609 Code: e3; Termination: Wraparound; Resistor Type: FIXED RESISTOR; Construction: Chip; Package Style: SMTMeter; Packaging: Tape and Reel; Technology: METAL GLAZE/THICK FILM; Working Voltage: 150V; Reach SVHC Compliant: Yes; RoHS Compliant: Yes; ComponentLink1URL: https://datasheet.ciiva.com:443/pdfs/VipMasterIC/IC/YAGO/YAGO-S-A0008145938/YAGO-S-A0008145938-1.pdf?src-supplier=IHS+Markit; ComponentLink1Description: https://datasheet.ciiva.com:443/pdfs/VipMasterIC/IC/YAGO/YAGO-S-A0008145938/YAGO-S-A0008145938-1.pdf?src-supplier=IHS+Markit